# Altium project PWR_MNG.PRJPCB
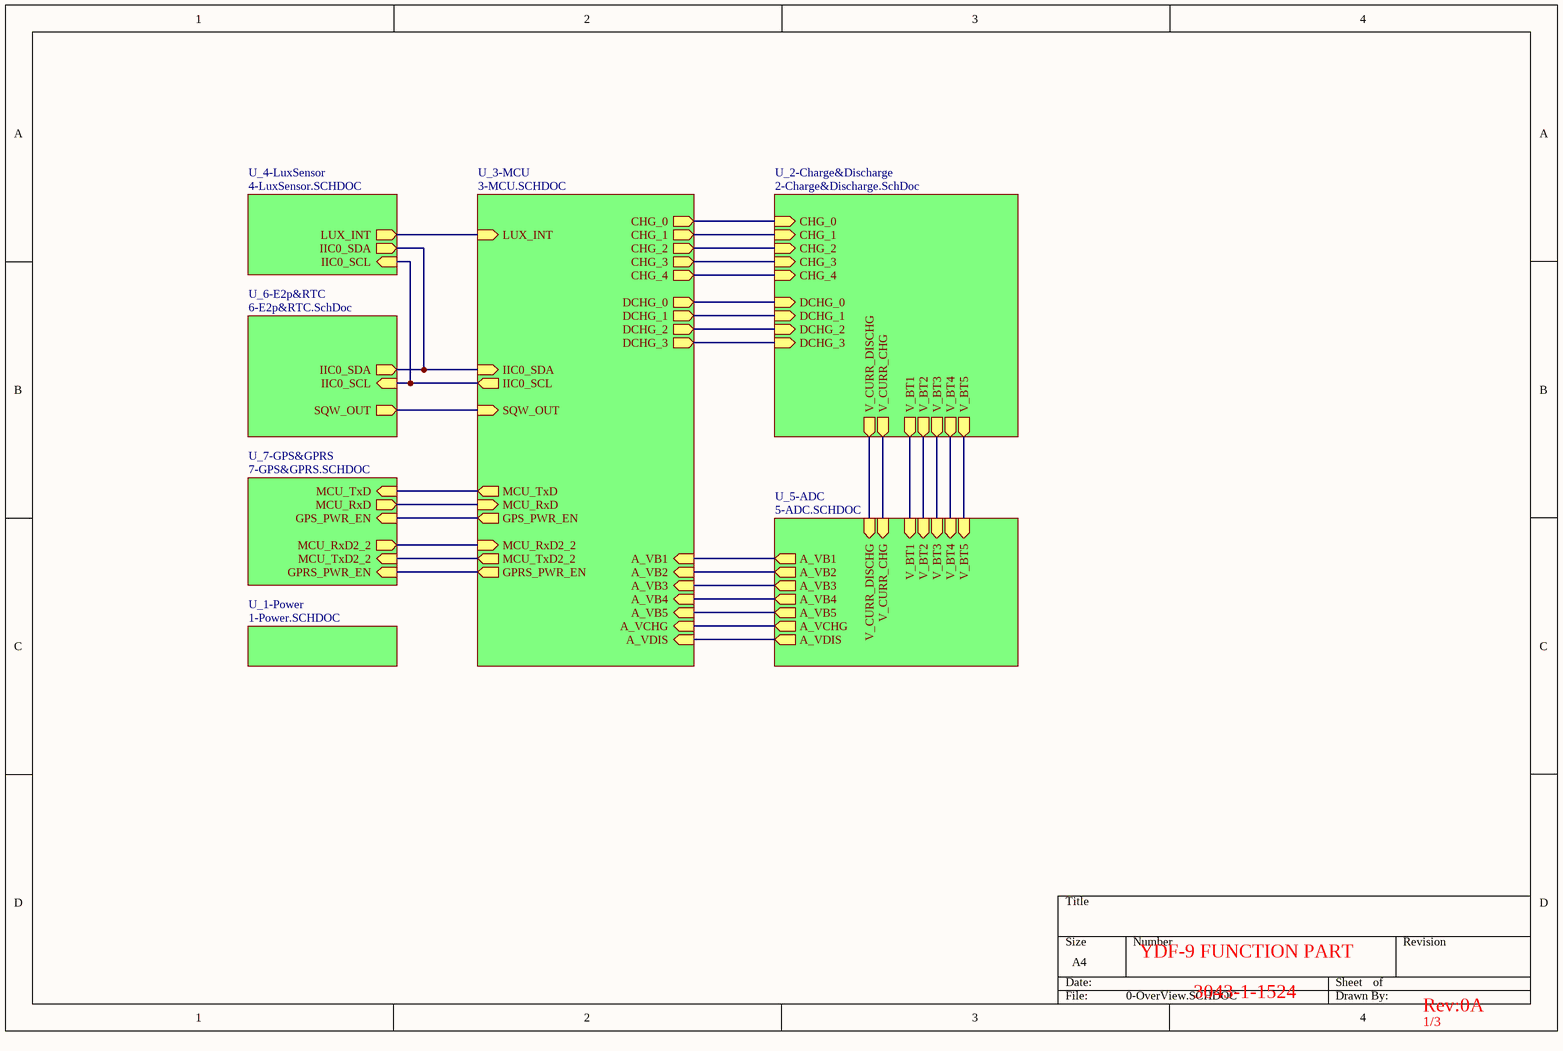
[diagram p0: 0-OverView.SCHDOC]
.TITLE: aaaaa
8 sheets, 152 parts. Net scope: hierarchical (ports join the sheet entries above them; power ports are global).
Board file: 3043-1-1532.PcbDoc
Sheets:
  0-OverView.SCHDOC
    U_2-Charge&Discharge = 2-Charge&Discharge.SchDoc
    U_1-Power = 1-Power.SCHDOC
    U_3-MCU = 3-MCU.SCHDOC
    U_5-ADC = 5-ADC.SCHDOC
    U_6-E2p&RTC = 6-E2p&RTC.SchDoc
    U_4-LuxSensor = 4-LuxSensor.SCHDOC
    U_7-GPS&GPRS = 7-GPS&GPRS.SCHDOC

## Sheet 0-OverView.SCHDOC
size A4

### Sub-sheets
U_1-Power = 1-Power.SCHDOC: no entries
U_2-Charge&Discharge = 2-Charge&Discharge.SchDoc: V_BT1 (out), V_BT2 (out), V_BT3 (out), V_BT4 (out), V_BT5 (out), V_CURR_CHG (out), V_CURR_DISCHG (out), CHG_2 (in), CHG_3 (in), DCHG_0 (in), CHG_4 (in), CHG_0 (in), DCHG_1 (in), CHG_1 (in), DCHG_2 (in), DCHG_3 (in)
U_3-MCU = 3-MCU.SCHDOC: IIC0_SDA (in), IIC0_SCL (out), SQW_OUT (in), A_VDIS (in), A_VB5 (in), A_VCHG (in), A_VB1 (in), A_VB4 (in), A_VB2 (in), A_VB3 (in), GPRS_PWR_EN (out), MCU_RxD2_2 (in), GPS_PWR_EN (out), MCU_TxD2_2 (out), MCU_RxD (in), CHG_3 (out), CHG_4 (out), CHG_0 (out), CHG_1 (out), CHG_2 (out), DCHG_0 (out), DCHG_1 (out), DCHG_2 (out), DCHG_3 (out), LUX_INT (in), MCU_TxD (out)
U_4-LuxSensor = 4-LuxSensor.SCHDOC: IIC0_SCL (in), IIC0_SDA (out), LUX_INT (out)
U_5-ADC = 5-ADC.SCHDOC: V_BT5 (in), V_BT3 (in), V_BT2 (in), V_BT4 (in), V_BT1 (in), A_VDIS (out), A_VB3 (out), A_VB5 (out), A_VB1 (out), A_VB4 (out), A_VCHG (out), A_VB2 (out), V_CURR_DISCHG (in), V_CURR_CHG (in)
U_6-E2p&RTC = 6-E2p&RTC.SchDoc: IIC0_SCL (in), IIC0_SDA (out), SQW_OUT (out)
U_7-GPS&GPRS = 7-GPS&GPRS.SCHDOC: GPS_PWR_EN (in), MCU_RxD (out), MCU_TxD2_2 (in), GPRS_PWR_EN (in), MCU_RxD2_2 (out), MCU_TxD (in)

### Nets
A_VB1: sheet U_3-MCU/A_VB1, sheet U_5-ADC/A_VB1
A_VB2: sheet U_3-MCU/A_VB2, sheet U_5-ADC/A_VB2
A_VB3: sheet U_3-MCU/A_VB3, sheet U_5-ADC/A_VB3
A_VB4: sheet U_3-MCU/A_VB4, sheet U_5-ADC/A_VB4
A_VB5: sheet U_3-MCU/A_VB5, sheet U_5-ADC/A_VB5
A_VCHG: sheet U_2-Charge&Discharge/V_CURR_CHG, sheet U_3-MCU/A_VCHG, sheet U_5-ADC/A_VCHG, sheet U_5-ADC/V_CURR_CHG
A_VDIS: sheet U_2-Charge&Discharge/V_CURR_DISCHG, sheet U_3-MCU/A_VDIS, sheet U_5-ADC/A_VDIS, sheet U_5-ADC/V_CURR_DISCHG
CHG_0: sheet U_2-Charge&Discharge/CHG_0, sheet U_3-MCU/CHG_0
CHG_1: sheet U_2-Charge&Discharge/CHG_1, sheet U_3-MCU/CHG_1
CHG_2: sheet U_2-Charge&Discharge/CHG_2, sheet U_3-MCU/CHG_2
CHG_3: sheet U_2-Charge&Discharge/CHG_3, sheet U_3-MCU/CHG_3
CHG_4: sheet U_2-Charge&Discharge/CHG_4, sheet U_3-MCU/CHG_4
DCHG_0: sheet U_2-Charge&Discharge/DCHG_0, sheet U_3-MCU/DCHG_0
DCHG_1: sheet U_2-Charge&Discharge/DCHG_1, sheet U_3-MCU/DCHG_1
DCHG_2: sheet U_2-Charge&Discharge/DCHG_2, sheet U_3-MCU/DCHG_2
DCHG_3: sheet U_2-Charge&Discharge/DCHG_3, sheet U_3-MCU/DCHG_3
GPRS_PWR_EN: sheet U_3-MCU/GPRS_PWR_EN, sheet U_7-GPS&GPRS/GPRS_PWR_EN
GPS_PWR_EN: sheet U_3-MCU/GPS_PWR_EN, sheet U_7-GPS&GPRS/GPS_PWR_EN
IIC0_SCL: sheet U_3-MCU/IIC0_SCL, sheet U_6-E2p&RTC/IIC0_SCL, sheet U_4-LuxSensor/IIC0_SCL
IIC0_SDA: sheet U_3-MCU/IIC0_SDA, sheet U_6-E2p&RTC/IIC0_SDA, sheet U_4-LuxSensor/IIC0_SDA
LUX_INT: sheet U_3-MCU/LUX_INT, sheet U_4-LuxSensor/LUX_INT
MCU_RxD: sheet U_3-MCU/MCU_RxD, sheet U_7-GPS&GPRS/MCU_RxD
MCU_RxD2_2: sheet U_3-MCU/MCU_RxD2_2, sheet U_7-GPS&GPRS/MCU_RxD2_2
MCU_TxD: sheet U_3-MCU/MCU_TxD, sheet U_7-GPS&GPRS/MCU_TxD
MCU_TxD2_2: sheet U_3-MCU/MCU_TxD2_2, sheet U_7-GPS&GPRS/MCU_TxD2_2
SQW_OUT: sheet U_3-MCU/SQW_OUT, sheet U_6-E2p&RTC/SQW_OUT
V_BT1: sheet U_2-Charge&Discharge/V_BT1, sheet U_5-ADC/V_BT1
V_BT2: sheet U_2-Charge&Discharge/V_BT2, sheet U_5-ADC/V_BT2
V_BT3: sheet U_2-Charge&Discharge/V_BT3, sheet U_5-ADC/V_BT3
V_BT4: sheet U_2-Charge&Discharge/V_BT4, sheet U_5-ADC/V_BT4
V_BT5: sheet U_2-Charge&Discharge/V_BT5, sheet U_5-ADC/V_BT5

### Notes on the sheet
- YDF-9 FUNCTION PART
- 3043-1-1524
- Rev:0A
- 1/3

## Sheet 2-Charge&Discharge.SchDoc
size A4
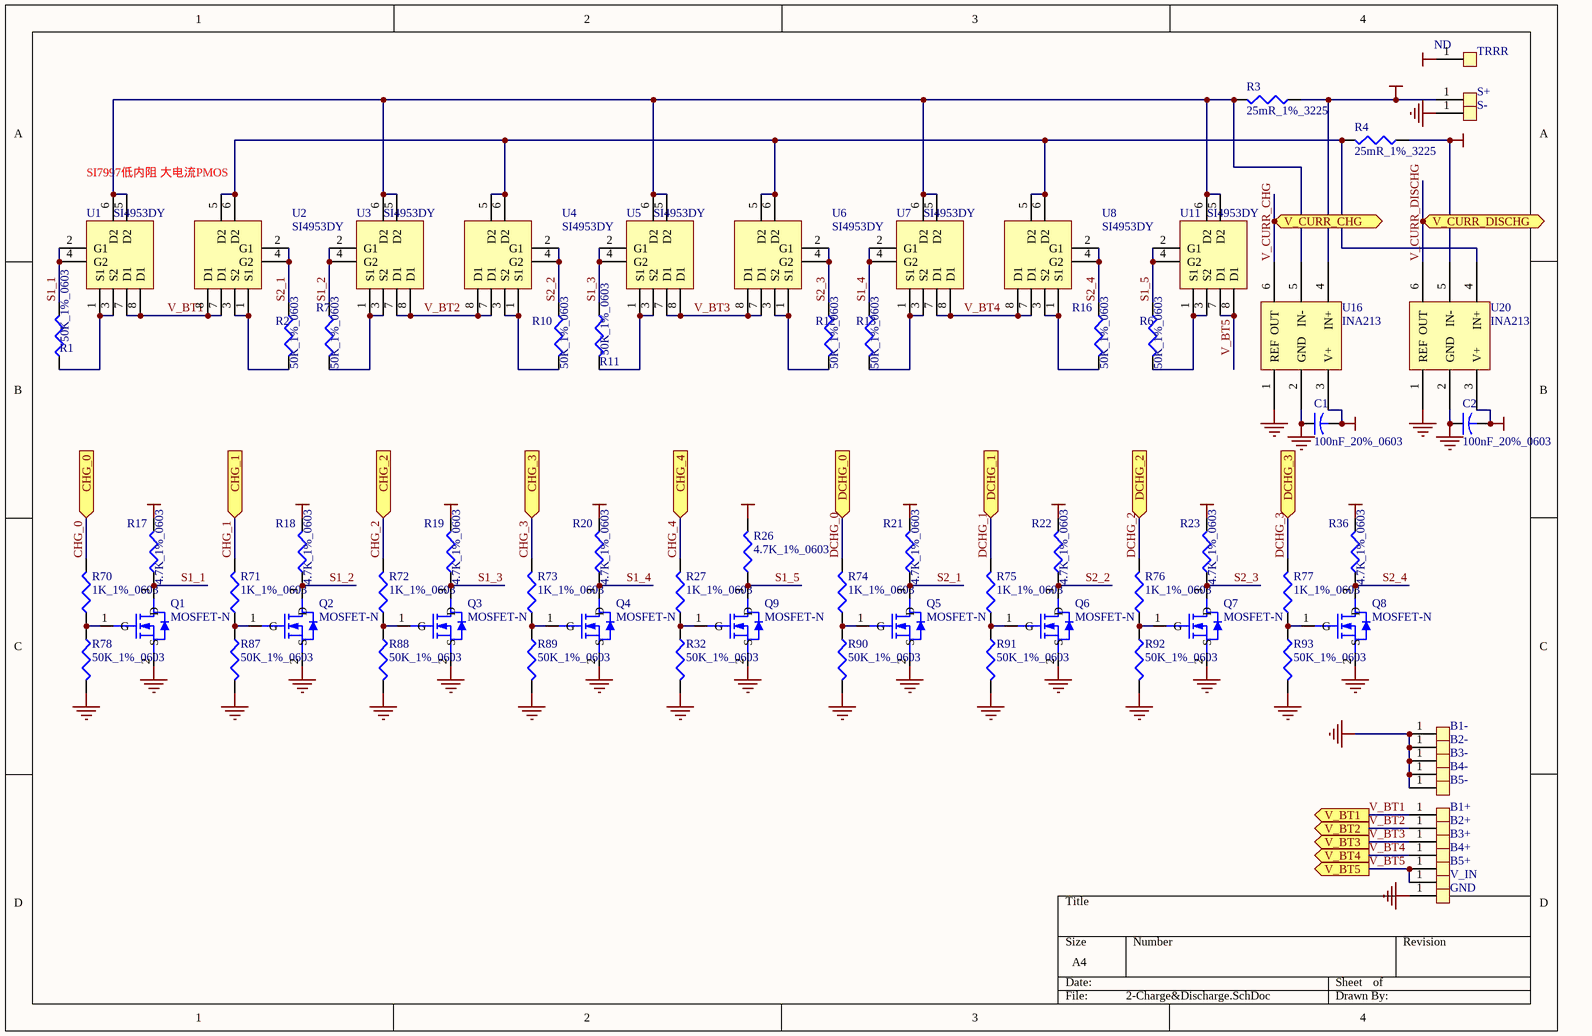
[diagram p1: 2-Charge&Discharge.SchDoc]

### Parts
B1+  ND  [END_1.5_2.8]  (value not drawn)
B1-  ND  [END_1.5_2.8]  (value not drawn)
B2+  ND  [END_1.5_2.8]  (value not drawn)
B2-  ND  [END_1.5_2.8]  (value not drawn)
B3+  ND  [END_1.5_2.8]  (value not drawn)
B3-  ND  [END_1.5_2.8]  (value not drawn)
B4+  ND  [END_1.5_2.8]  (value not drawn)
B4-  ND  [END_1.5_2.8]  (value not drawn)
B5+  ND  [END_1.5_2.8]  (value not drawn)
B5-  ND  [END_1.5_2.8]  (value not drawn)
C1  100nF_20%_0603  [C1608-0603]
C2  100nF_20%_0603  [C1608-0603]
GND  ND  [END_3_6]  (value not drawn)
Q1  MOSFET-N  [SO-G3/C2.5]
Q2  MOSFET-N  [SO-G3/C2.5]
Q3  MOSFET-N  [SO-G3/C2.5]
Q4  MOSFET-N  [SO-G3/C2.5]
Q5  MOSFET-N  [SO-G3/C2.5]
Q6  MOSFET-N  [SO-G3/C2.5]
Q7  MOSFET-N  [SO-G3/C2.5]
Q8  MOSFET-N  [SO-G3/C2.5]
Q9  MOSFET-N  [SO-G3/C2.5]
R1  50K_1%_0603  [C1608-0603]
R2  50K_1%_0603  [C1608-0603]
R3  25mR_1%_3225  [CR6332-2512]
R4  25mR_1%_3225  [CR6332-2512]
R6  50K_1%_0603  [C1608-0603]
R7  50K_1%_0603  [C1608-0603]
R10  50K_1%_0603  [C1608-0603]
R11  50K_1%_0603  [C1608-0603]
R12  50K_1%_0603  [C1608-0603]
R13  50K_1%_0603  [C1608-0603]
R16  50K_1%_0603  [C1608-0603]
R17  4.7K_1%_0603  [C1608-0603]
R18  4.7K_1%_0603  [C1608-0603]
R19  4.7K_1%_0603  [C1608-0603]
R20  4.7K_1%_0603  [C1608-0603]
R21  4.7K_1%_0603  [C1608-0603]
R22  4.7K_1%_0603  [C1608-0603]
R23  4.7K_1%_0603  [C1608-0603]
R26  4.7K_1%_0603  [C1608-0603]
R27  1K_1%_0603  [C1608-0603]
R32  50K_1%_0603  [C1608-0603]
R36  4.7K_1%_0603  [C1608-0603]
R70  1K_1%_0603  [C1608-0603]
R71  1K_1%_0603  [C1608-0603]
R72  1K_1%_0603  [C1608-0603]
R73  1K_1%_0603  [C1608-0603]
R74  1K_1%_0603  [C1608-0603]
R75  1K_1%_0603  [C1608-0603]
R76  1K_1%_0603  [C1608-0603]
R77  1K_1%_0603  [C1608-0603]
R78  50K_1%_0603  [C1608-0603]
R87  50K_1%_0603  [C1608-0603]
R88  50K_1%_0603  [C1608-0603]
R89  50K_1%_0603  [C1608-0603]
R90  50K_1%_0603  [C1608-0603]
R91  50K_1%_0603  [C1608-0603]
R92  50K_1%_0603  [C1608-0603]
R93  50K_1%_0603  [C1608-0603]
S+  ND  [END_1.5_2.8]  (value not drawn)
S-  ND  [END_1.5_2.8]  (value not drawn)
TRRR  ND  [END_1.5_2.8]
U1  SI4953DY  [SO-8]
U2  SI4953DY  [SO-8]
U3  SI4953DY  [SO-8]
U4  SI4953DY  [SO-8]
U5  SI4953DY  [SO-8]
U6  SI4953DY  [SO-8]
U7  SI4953DY  [SO-8]
U8  SI4953DY  [SO-8]
U11  SI4953DY  [SO-8]
U16  INA213  [SC70-6]
U20  INA213  [SC70-6]
V_IN  ND  [END_3_6]  (value not drawn)

### Ports
CHG_0 (in), CHG_1 (in), CHG_2 (in), CHG_3 (in), CHG_4 (in), DCHG_0 (in), DCHG_1 (in), DCHG_2 (in), DCHG_3 (in), V_BT1 (out), V_BT2 (out), V_BT3 (out), V_BT4 (out), V_BT5 (out), V_CURR_CHG (out), V_CURR_DISCHG (out)

### Nets
GND: B1-.1(SW) B2-.1(SW) B3-.1(SW) B4-.1(SW) B5-.1(SW) C1.1 C2.1 GND.1(SW) Q1.2(S) Q2.2(S) Q3.2(S) Q4.2(S) Q5.2(S) Q6.2(S) Q7.2(S) Q8.2(S) Q9.2(S) R32.2 R78.2 R87.2 R88.2 R89.2 R90.2 R91.2 R92.2 R93.2 S-.1(SW) U16.1(REF) U16.2(GND) U20.1(REF) U20.2(GND)
VCC_2V8: C1.2 C2.2 U16.3(V+) U20.3(V+)
VCC_BAT: R4.1 U20.5(IN-)
VCC_CHARGE: R3.1 S+.1(SW) U16.4(IN+)
VCC_SOLAR: TRRR.1(SW)
VCC_TH: R17.2 R18.2 R19.2 R20.2 R21.2 R22.2 R23.2 R26.2 R36.2
CHG_0: R70.2 ; port CHG_0
CHG_1: R71.2 ; port CHG_1
CHG_2: R72.2 ; port CHG_2
CHG_3: R73.2 ; port CHG_3
CHG_4: R27.2 ; port CHG_4
DCHG_0: R74.2 ; port DCHG_0
DCHG_1: R75.2 ; port DCHG_1
DCHG_2: R76.2 ; port DCHG_2
DCHG_3: R77.2 ; port DCHG_3
S1_1: Q1.3(D) R1.2 R17.1 U1.2(G1) U1.4(G2)
S1_2: Q2.3(D) R7.1 R18.1 U3.2(G1) U3.4(G2)
S1_3: Q3.3(D) R11.1 R19.1 U5.2(G1) U5.4(G2)
S1_4: Q4.3(D) R13.1 R20.1 U7.2(G1) U7.4(G2)
S1_5: Q9.3(D) R6.1 R26.1 U11.2(G1) U11.4(G2)
S2_1: Q5.3(D) R2.1 R21.1 U2.2(G1) U2.4(G2)
S2_2: Q6.3(D) R10.1 R22.1 U4.2(G1) U4.4(G2)
S2_3: Q7.3(D) R12.1 R23.1 U6.2(G1) U6.4(G2)
S2_4: Q8.3(D) R16.1 R36.1 U8.2(G1) U8.4(G2)
V_BT1: B1+.1(SW) U1.7(D1) U1.8(D1) U2.7(D1) U2.8(D1) ; port V_BT1
V_BT2: B2+.1(SW) U3.7(D1) U3.8(D1) U4.7(D1) U4.8(D1) ; port V_BT2
V_BT3: B3+.1(SW) U5.7(D1) U5.8(D1) U6.7(D1) U6.8(D1) ; port V_BT3
V_BT4: B4+.1(SW) U7.7(D1) U7.8(D1) U8.7(D1) U8.8(D1) ; port V_BT4
V_BT5: B5+.1(SW) U11.7(D1) U11.8(D1) V_IN.1(SW) ; port V_BT5
V_CURR_CHG: U16.6(OUT) ; port V_CURR_CHG  [project net A_VCHG]
V_CURR_DISCHG: U20.6(OUT) ; port V_CURR_DISCHG  [project net A_VDIS]
NetQ1_1: Q1.1(G) R70.1 R78.1
NetQ2_1: Q2.1(G) R71.1 R87.1
NetQ3_1: Q3.1(G) R72.1 R88.1
NetQ4_1: Q4.1(G) R73.1 R89.1
NetQ5_1: Q5.1(G) R74.1 R90.1
NetQ6_1: Q6.1(G) R75.1 R91.1
NetQ7_1: Q7.1(G) R76.1 R92.1
NetQ8_1: Q8.1(G) R77.1 R93.1
NetQ9_1: Q9.1(G) R27.1 R32.1
NetR1_1: R1.1 U1.1(S1) U1.3(S2)
NetR2_2: R2.2 U2.1(S1) U2.3(S2)
NetR3_2: R3.2 U1.5(D2) U1.6(D2) U3.5(D2) U3.6(D2) U5.5(D2) U5.6(D2) U7.5(D2) U7.6(D2) U11.5(D2) U11.6(D2) U16.5(IN-)
NetR4_2: R4.2 U2.5(D2) U2.6(D2) U4.5(D2) U4.6(D2) U6.5(D2) U6.6(D2) U8.5(D2) U8.6(D2) U20.4(IN+)
NetR6_2: R6.2 U11.1(S1) U11.3(S2)
NetR7_2: R7.2 U3.1(S1) U3.3(S2)
NetR10_2: R10.2 U4.1(S1) U4.3(S2)
NetR11_2: R11.2 U5.1(S1) U5.3(S2)
NetR12_2: R12.2 U6.1(S1) U6.3(S2)
NetR13_2: R13.2 U7.1(S1) U7.3(S2)
NetR16_2: R16.2 U8.1(S1) U8.3(S2)

### Notes on the sheet
- SI7997低内阻 大电流PMOS

### Library data of the parts
C1 C2 = Cap2: Capacitor; Value: 0.1uF 20% 0603; Published: 23-Sep-2002; Publisher: Altium Limited
R1 R2 R6 R7 R10-R13 R16-R23 R26 R27 R32 R36 R70-R78 R87-R93 = Res3: Resistor; Value: 1K%5 0603; Published: 8-Jun-2000; Revision: July-2002: Re-released for DXP Platform.; Publisher: Altium Limited
R3 R4 = Res3: Resistor; Value: 150R %5 0603; Published: 8-Jun-2000; Revision: July-2002: Re-released for DXP Platform.; Publisher: Altium Limited

## Sheet 1-Power.SCHDOC
size A4
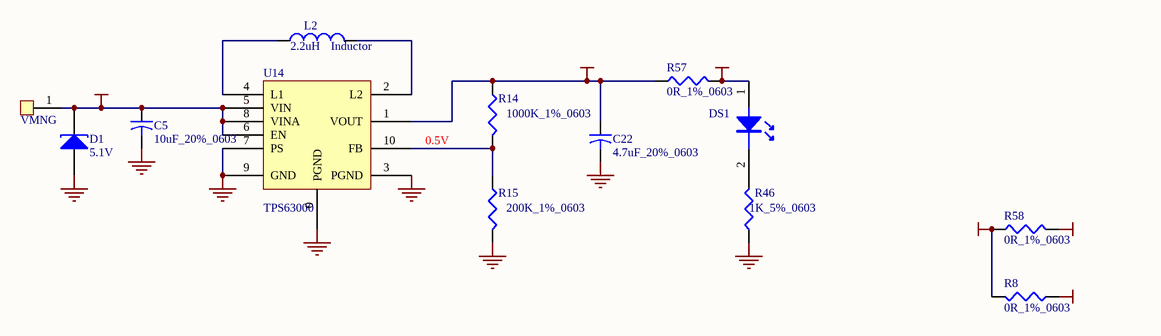
[diagram p2: 1-Power.SCHDOC]

### Parts
C5  10uF_20%_0603  [C1608-0603]
C22  4.7uF_20%_0603  [C1608-0603]
D1  5.1V  [LED0805]
DS1  LED  [LED0805]  (value not drawn)
L2  Inductor  value 2.2uH  [L3x3x1.5_5A]
R8  0R_1%_0603  [C1608-0603]
R14  1000K_1%_0603  [C1608-0603]
R15  200K_1%_0603  [C1608-0603]
R46  1K_5%_0603  [C1608-0603]
R57  0R_1%_0603  [C1608-0603]
R58  0R_1%_0603  [C1608-0603]
U14  TPS63000  [QFN-10]
VMNG  ND  [END_3_6]  (value not drawn)

### Nets
GND: C5.2 C22.2 D1.1(A) R15.2 R46.1 U14.0(PGND) U14.3(PGND) U14.7(PS) U14.9(GND)
VCC_2V8: DS1.1 R8.2 R57.2 R58.1
VCC_MCU: R8.1
VCC_MNG: C5.1 D1.2(K) U14.5(VIN) U14.6(EN) U14.8(VINA) VMNG.1(SW)
VCC_OUT: C22.1 R14.1 R57.1 U14.1(VOUT)
VCC_TH: R58.2
NetDS1_2: DS1.2 R46.2
NetL2_1: L2.1 U14.4(L1)
NetL2_2: L2.2 U14.2(L2)
NetR14_2: R14.2 R15.1 U14.10(FB)

### Notes on the sheet
- 0.5V

### Library data of the parts
C5 C22 = Cap2: Capacitor; Value: 0.1uF 20% 0603; Published: 23-Sep-2002; Publisher: Altium Limited
D1 = D Tunnel1: Tunnel Diode - RLC Model; Published: 8-Jun-2000; LatestRevisionDate: 17-Jul-2002; LatestRevisionNote: Re-released for DXP Platform.; Publisher: Altium Limited
R8 R14 R15 R57 R58 = Res3: Resistor; Value: 1K%5 0603; Published: 8-Jun-2000; Revision: July-2002: Re-released for DXP Platform.; Publisher: Altium Limited
R46 = Res3: Resistor; Value: 1K; Published: 8-Jun-2000; Revision: July-2002: Re-released for DXP Platform.; Publisher: Altium Limited
L2 = Inductor: Published: 8-Jun-2000; Revision: July-2002: Re-released for DXP Platform.; Publisher: Altium Limited

## Sheet 3-MCU.SCHDOC
size A4
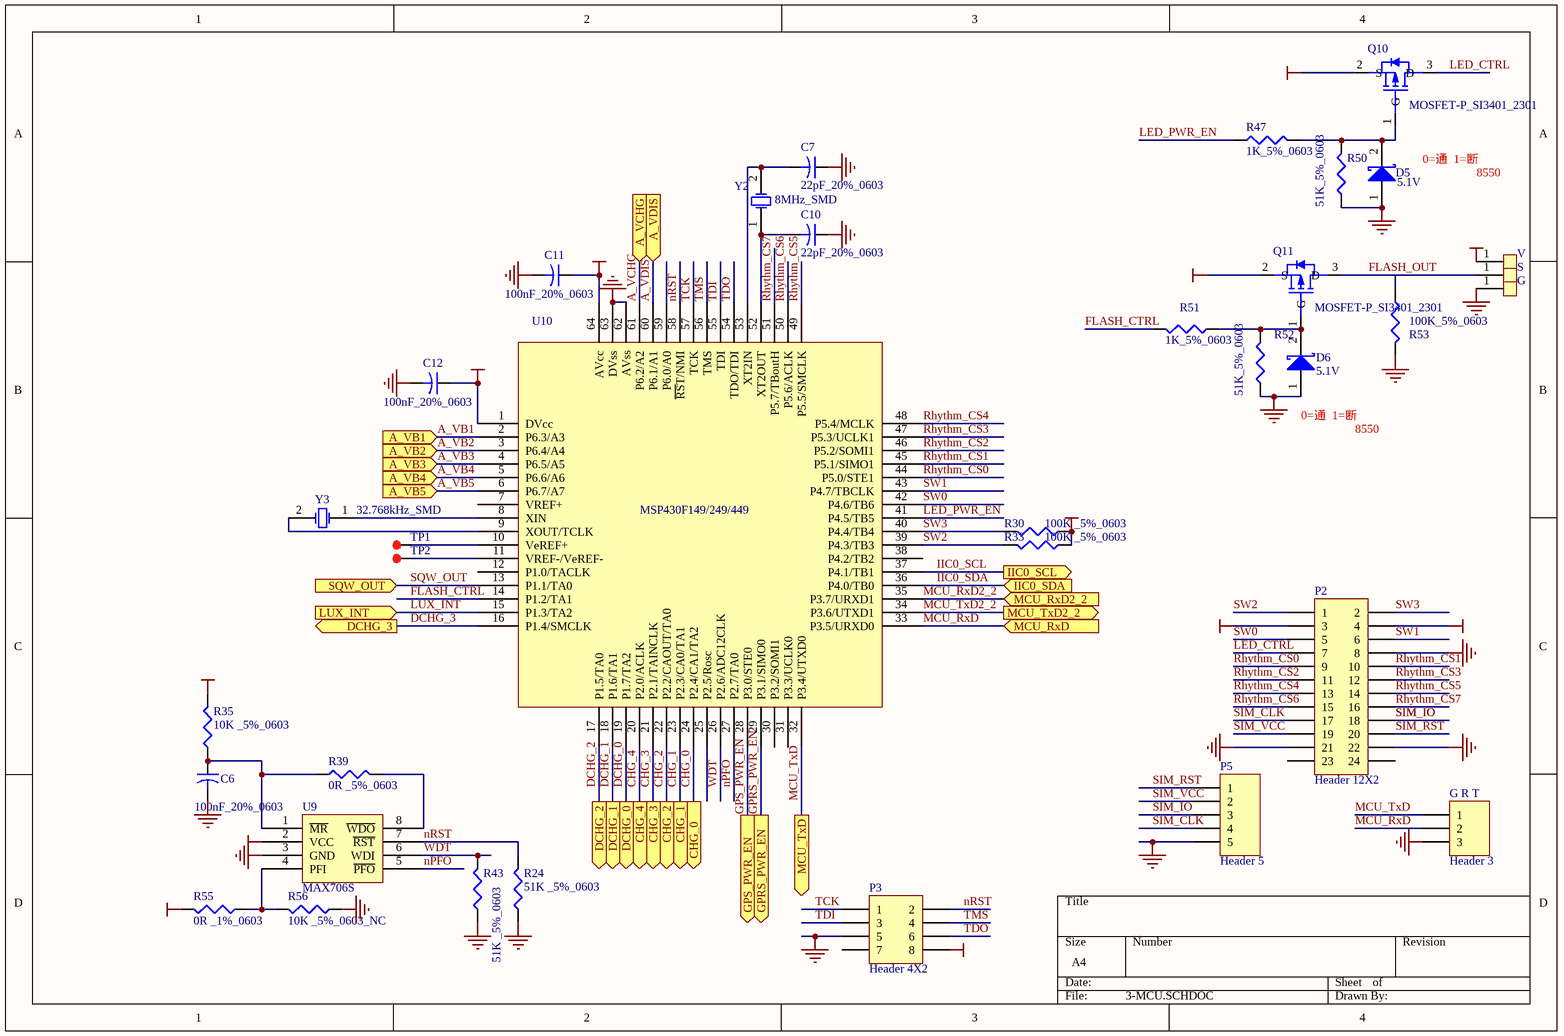
[diagram p3: 3-MCU.SCHDOC]

### Parts
C6  100nF_20%_0603  [C1608-0603]
C7  22pF_20%_0603  [C1608-0603]
C10  22pF_20%_0603  [C1608-0603]
C11  100nF_20%_0603  [C1608-0603]
C12  100nF_20%_0603  [C1608-0603]
D5  5.1V  [LED0805]
D6  5.1V  [LED0805]
G  ND  [END_1.5_2.8]  (value not drawn)
G_R_T  Header 3  [XH-03H]
P2  Header 12X2  [HDR2X12]
P3  Header 4X2  [HDR2X4]
P5  Header 5  [HDR1X5]
Q10  MOSFET-P_SI3401_2301  [SO-G3/C2.5]
Q11  MOSFET-P_SI3401_2301  [SO-G3/C2.5]
R24  51K _5%_0603  [C1608-0603]
R30  100K _5%_0603  [C1608-0603]
R33  100K _5%_0603  [C1608-0603]
R35  10K _5%_0603  [C1608-0603]
R39  0R _5%_0603  [C1608-0603]
R43  51K _5%_0603  [C1608-0603]
R47  1K_5%_0603  [C1608-0603]
R50  51K_5%_0603  [C1608-0603]
R51  1K_5%_0603  [C1608-0603]
R52  51K_5%_0603  [C1608-0603]
R53  100K_5%_0603  [C1608-0603]
R55  0R _1%_0603  [C1608-0603]
R56  10K _5%_0603_NC  [C1608-0603]
S  ND  [END_1.5_2.8]  (value not drawn)
TP1  TP  [TP_1MM]  (value not drawn)
TP2  TP  [TP_1MM]  (value not drawn)
U9  MAX706S  [SO-8]
U10  MSP430F149/249/449  [QFP-64]
V  ND  [END_1.5_2.8]  (value not drawn)
Y2  8MHz_SMD  [XTAL-P4mm_SMD]
Y3  32.768kHz_SMD  [XTAL-3216]

### Ports
A_VB1 (in), A_VB2 (in), A_VB3 (in), A_VB4 (in), A_VB5 (in), A_VCHG (in), A_VDIS (in), CHG_0 (out), CHG_1 (out), CHG_2 (out), CHG_3 (out), CHG_4 (out), DCHG_0 (out), DCHG_1 (out), DCHG_2 (out), DCHG_3 (out), GPRS_PWR_EN (out), GPS_PWR_EN (out), IIC0_SCL (out), IIC0_SDA (in), LUX_INT (in), MCU_RxD2_2 (in), MCU_RxD (in), MCU_TxD2_2 (out), MCU_TxD (out), SQW_OUT (in)

### Nets
GND: C6.2 C7.1 C10.1 C11.2 C12.2 D5.1(A) D6.1(A) G.1(SW) G_R_T.3 P2.8 P2.21 P2.22 P3.5 P5.5 R24.1 R43.1 R50.1 R52.1 R53.2 R56.1 U9.3(GND) U10.62(AVss) U10.63(DVss)
VCC_2V8: P2.3 P2.4 Q10.2(S) Q11.2(S)
VCC_BAT: V.1(SW)
VCC_MCU: C11.1 C12.1 P3.8 R30.1 R33.1 R35.2 U9.2(VCC) U10.1(DVcc) U10.64(AVcc)
VCC_SOLAR: R55.2
A_VB1: U10.2(P6.3/A3) ; port A_VB1
A_VB2: U10.3(P6.4/A4) ; port A_VB2
A_VB3: U10.4(P6.5/A5) ; port A_VB3
A_VB4: U10.5(P6.6/A6) ; port A_VB4
A_VB5: U10.6(P6.7/A7) ; port A_VB5
A_VCHG: U10.61(P6.2/A2) ; port A_VCHG
A_VDIS: U10.60(P6.1/A1) ; port A_VDIS
CHG_0: U10.24(P2.4/CA1/TA2) ; port CHG_0
CHG_1: U10.23(P2.3/CA0/TA1) ; port CHG_1
CHG_2: U10.22(P2.2/CAOUT/TA0) ; port CHG_2
CHG_3: U10.21(P2.1/TAINCLK) ; port CHG_3
CHG_4: U10.20(P2.0/ACLK) ; port CHG_4
DCHG_0: U10.19(P1.7/TA2) ; port DCHG_0
DCHG_1: U10.18(P1.6/TA1) ; port DCHG_1
DCHG_2: U10.17(P1.5/TA0) ; port DCHG_2
DCHG_3: U10.16(P1.4/SMCLK) ; port DCHG_3
FLASH_CTRL: R51.2 U10.14(P1.2/TA1)
FLASH_OUT: Q11.3(D) R53.1 S.1(SW)
GPRS_PWR_EN: U10.29(P3.1/SIMO0) ; port GPRS_PWR_EN
GPS_PWR_EN: U10.28(P3.0/STE0) ; port GPS_PWR_EN
IIC0_SCL: U10.37(P4.1/TB1) ; port IIC0_SCL
IIC0_SDA: U10.36(P4.0/TB0) ; port IIC0_SDA
LED_CTRL: P2.7 Q10.3(D)
LED_PWR_EN: R47.1 U10.41(P4.5/TB5)
LUX_INT: U10.15(P1.3/TA2) ; port LUX_INT
MCU_RxD: G_R_T.2 U10.33(P3.5/URXD0) ; port MCU_RxD
MCU_RxD2_2: U10.35(P3.7/URXD1) ; port MCU_RxD2_2
MCU_TxD: G_R_T.1 U10.32(P3.4/UTXD0) ; port MCU_TxD
MCU_TxD2_2: U10.34(P3.6/UTXD1) ; port MCU_TxD2_2
nPFO: U9.5(~{PFO}) U10.27(P2.7/TA0)
nRST: P3.2 R24.2 U9.7(~{RST}) U10.58(~{RS}T/NMI)
Rhythm_CS0: P2.9 U10.44(P5.0/STE1)
Rhythm_CS1: P2.10 U10.45(P5.1/SIMO1)
Rhythm_CS2: P2.11 U10.46(P5.2/SOMI1)
Rhythm_CS3: P2.12 U10.47(P5.3/UCLK1)
Rhythm_CS4: P2.13 U10.48(P5.4/MCLK)
Rhythm_CS5: P2.14 U10.49(P5.5/SMCLK)
Rhythm_CS6: P2.15 U10.50(P5.6/ACLK)
Rhythm_CS7: P2.16 U10.51(P5.7/TBoutH)
SIM_CLK: P2.17 P5.4
SIM_IO: P2.18 P5.3
SIM_RST: P2.20 P5.1
SIM_VCC: P2.19 P5.2
SQW_OUT: U10.13(P1.1/TA0) ; port SQW_OUT
SW0: P2.5 U10.42(P4.6/TB6)
SW1: P2.6 U10.43(P4.7/TBCLK)
SW2: P2.1 R33.2 U10.39(P4.3/TB3)
SW3: P2.2 R30.2 U10.40(P4.4/TB4)
TCK: P3.1 U10.57(TCK)
TDI: P3.3 U10.55(TDI)
TDO: P3.6 U10.54(TDO/TDI)
TMS: P3.4 U10.56(TMS)
WDT: R43.2 U9.6(WDI) U10.26(P2.6/ADC12CLK)
NetC6_1: C6.1 R35.1 R39.1 U9.1(~{MR})
NetC7_2: C7.2 U10.53(XT2IN) Y2.2(OSC2)
NetC10_2: C10.2 U10.52(XT2OUT) Y2.1(OSC1)
NetD5_2: D5.2(K) Q10.1(G) R47.2 R50.2
NetD6_2: D6.2(K) Q11.1(G) R51.1 R52.2
NetR39_2: R39.2 U9.8(~{WDO})
NetR55_1: R55.1 R56.2 U9.4(PFI)
NetTP1_1: TP1.1(TP) U10.10(VeREF+)
NetTP2_1: TP2.1(TP) U10.11(VREF-/VeREF-)
NetU10_8: U10.8(XIN) Y3.1(OSC1)
NetU10_9: U10.9(XOUT/TCLK) Y3.2(OSC2)

Not connected (* = marked no-connect by the designer): P2 23 24; P3 7; U10 7(VREF+) 12(P1.0/TACLK) 25(P2.5/Rosc) 30(P3.2/SOMI1) 31(P3.3/UCLK0) 38(P4.2/TB2) 59(P6.0/A0)

### Notes on the sheet
- 0=通  1=断
- 8550

### Library data of the parts
C6 = Cap2: Capacitor; Value: 0.1uF 0603; Published: 23-Sep-2002; Publisher: Altium Limited
C7 C10-C12 = Cap2: Capacitor; Value: 0.1uF 20% 0603; Published: 23-Sep-2002; Publisher: Altium Limited
D5 D6 = D Schottky: Schottky Diode; Code - JEDEC: DO-214-AA; Published: 8-Jun-2000; Revision: July-2002: Re-released for DXP Platform.; Publisher: Altium Limited
G_R_T = Header 3: Header, 3-Pin; LatestRevisionDate: 17-Jul-2002; LatestRevisionNote: Re-released for DXP Platform.; Publisher: Altium Limited
P2 = Header 12X2: Header, 12-Pin, Dual row; LatestRevisionDate: 17-Jul-2002; LatestRevisionNote: Re-released for DXP Platform.; Publisher: Altium Limited
P3 = Header 4X2: Header, 4-Pin, Dual row; LatestRevisionDate: 17-Jul-2002; LatestRevisionNote: Re-released for DXP Platform.; Publisher: Altium Limited
P5 = Header 5: Header, 5-Pin; LatestRevisionDate: 17-Jul-2002; LatestRevisionNote: Re-released for DXP Platform.; Publisher: Altium Limited
Q10 Q11 = MOSFET-P
R24 R30 R33 R35 R39 R43 R55 R56 = Res3: Resistor; Value: 1M %5 0603_NC; Published: 8-Jun-2000; Revision: July-2002: Re-released for DXP Platform.; Publisher: Altium Limited
R47 = Res3: Resistor; Value: 1K%5 0603; Published: 8-Jun-2000; Revision: July-2002: Re-released for DXP Platform.; Publisher: Altium Limited
R50-R53 = Res3: Resistor; Published: 8-Jun-2000; Revision: July-2002: Re-released for DXP Platform.; Publisher: Altium Limited
TP1 TP2 = TP_1mm
U9 = MAX706
Y2 Y3 = XTAL: Crystal Oscillator; Published: 8-Jun-2000; Revision: July-2002: Re-released for DXP Platform.; Publisher: Altium Limited

## Sheet 5-ADC.SCHDOC
size A4
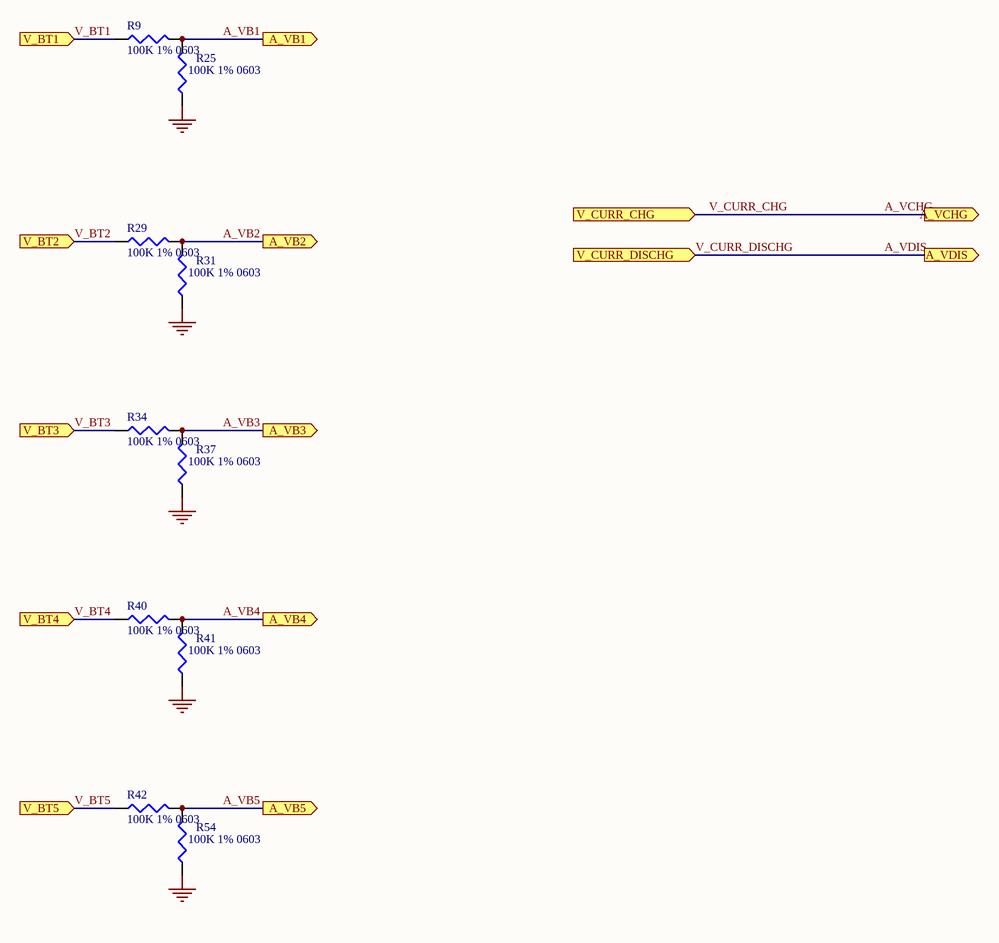
[diagram p4: 5-ADC.SCHDOC]

### Parts
R9  value 100K 1% 0603  [C1608-0603]  (hidden comment: 1K_5%_0603)
R25  value 100K 1% 0603  [C1608-0603]  (hidden comment: 1K_5%_0603)
R29  value 100K 1% 0603  [C1608-0603]  (hidden comment: 1K_5%_0603)
R31  value 100K 1% 0603  [C1608-0603]  (hidden comment: 1K_5%_0603)
R34  value 100K 1% 0603  [C1608-0603]  (hidden comment: 1K_5%_0603)
R37  value 100K 1% 0603  [C1608-0603]  (hidden comment: 1K_5%_0603)
R40  value 100K 1% 0603  [C1608-0603]  (hidden comment: 1K_5%_0603)
R41  value 100K 1% 0603  [C1608-0603]  (hidden comment: 1K_5%_0603)
R42  value 100K 1% 0603  [C1608-0603]  (hidden comment: 1K_5%_0603)
R54  value 100K 1% 0603  [C1608-0603]  (hidden comment: 1K_5%_0603)

### Ports
A_VB1 (out), A_VB2 (out), A_VB3 (out), A_VB4 (out), A_VB5 (out), A_VCHG (out), A_VDIS (out), V_BT1 (in), V_BT2 (in), V_BT3 (in), V_BT4 (in), V_BT5 (in), V_CURR_CHG (in), V_CURR_DISCHG (in)

### Nets
GND: R25.1 R31.1 R37.1 R41.1 R54.1
A_VB1: R9.2 R25.2 ; port A_VB1
A_VB2: R29.2 R31.2 ; port A_VB2
A_VB3: R34.2 R37.2 ; port A_VB3
A_VB4: R40.2 R41.2 ; port A_VB4
A_VB5: R42.2 R54.2 ; port A_VB5
A_VCHG: port A_VCHG, port V_CURR_CHG  [also labelled V_CURR_CHG]
A_VDIS: port A_VDIS, port V_CURR_DISCHG  [also labelled V_CURR_DISCHG]
V_BT1: R9.1 ; port V_BT1
V_BT2: R29.1 ; port V_BT2
V_BT3: R34.1 ; port V_BT3
V_BT4: R40.1 ; port V_BT4
V_BT5: R42.1 ; port V_BT5

### Library data of the parts
R9 R25 R29 R31 R34 R37 R40-R42 R54 = Res3: Resistor; Published: 8-Jun-2000; Revision: July-2002: Re-released for DXP Platform.; Publisher: Altium Limited

## Sheet 6-E2p&RTC.SchDoc
size A4
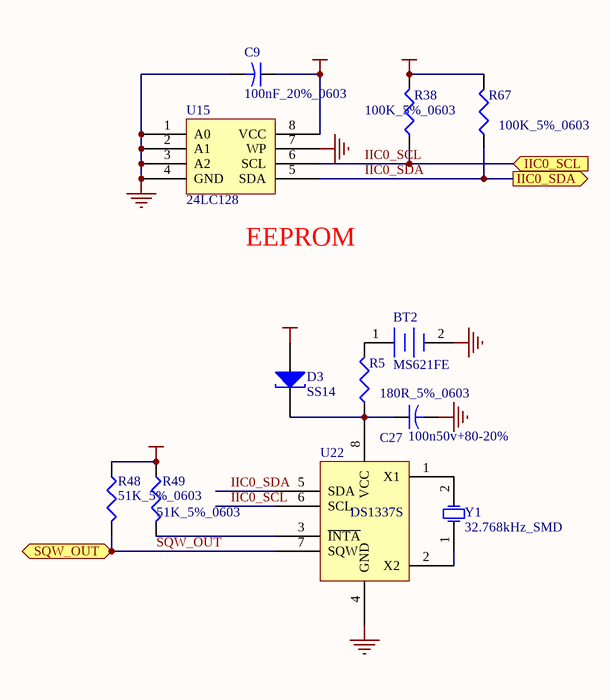
[diagram p5: 6-E2p&RTC.SchDoc]

### Parts
BT2  MS621FE  [BATT_BAK]
C9  100nF_20%_0603  [C1608-0603]
C27  value 100n50v+80-20%  [C1608-0603]  (hidden comment: Cap2)
D3  SS14  [LED0805]
R5  180R_5%_0603  [C1608-0603]
R38  100K_5%_0603  [C1608-0603]
R48  51K_5%_0603  [C1608-0603]
R49  51K_5%_0603  [C1608-0603]
R67  100K_5%_0603  [C1608-0603]
U15  24LC128  [8s1]
U22  DS1337S  [SO-8]
Y1  32.768kHz_SMD  [XTAL-3216]

### Ports
IIC0_SCL (in), IIC0_SDA (out), SQW_OUT (out)

### Nets
GND: BT2.2(-) C9.2 C27.2 U15.1(A0) U15.2(A1) U15.3(A2) U15.4(GND) U15.7(WP) U22.4(GND)
VCC_2V8: C9.1 D3.1(A) R38.2 R48.1 R49.1 R67.2 U15.8(VCC)
IIC0_SCL: R38.1 U15.6(SCL) U22.6(SCL) ; port IIC0_SCL
IIC0_SDA: R67.1 U15.5(SDA) U22.5(SDA) ; port IIC0_SDA
SQW_OUT: R48.2 U22.7(SQW) ; port SQW_OUT
NetBT2_1: BT2.1(+) R5.2
NetC27_1: C27.1 D3.2(K) R5.1 U22.8(VCC)
NetR49_2: R49.2 U22.3(~{INTA})
NetU22_1: U22.1(X1) Y1.2(OSC2)
NetU22_2: U22.2(X2) Y1.1(OSC1)

### Notes on the sheet
- (near U15) EEPROM

### Library data of the parts
BT2 = Battery: Multicell Battery; Published: 24-Mar-1999; Revision: July-2002: Re-released for DXP Platform.; Publisher: Altium Limited
C9 = Cap2: Capacitor; Value: 0.1uF 0603; Published: 23-Sep-2002; Publisher: Altium Limited
C27 = Cap2: Capacitor; Published: 23-Sep-2002; Publisher: Altium Limited
D3 = D Tunnel1: Tunnel Diode - RLC Model; Published: 8-Jun-2000; LatestRevisionDate: 17-Jul-2002; LatestRevisionNote: Re-released for DXP Platform.; Publisher: Altium Limited
R5 R38 R48 R49 R67 = Res3: Resistor; Value: 1K%5 0603; Published: 8-Jun-2000; Revision: July-2002: Re-released for DXP Platform.; Publisher: Altium Limited
U15 = 24LC02: IC
Y1 = XTAL: Crystal Oscillator; Published: 8-Jun-2000; Revision: July-2002: Re-released for DXP Platform.; Publisher: Altium Limited

## Sheet 4-LuxSensor.SCHDOC
size A4
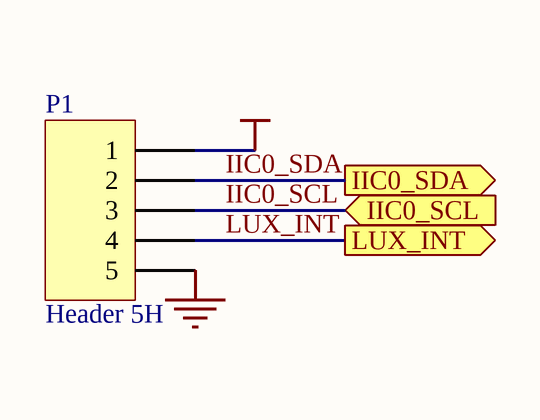
[diagram p6: 4-LuxSensor.SCHDOC]

### Parts
P1  Header 5H  [XH-05H]

### Ports
IIC0_SCL (in), IIC0_SDA (out), LUX_INT (out)

### Nets
GND: P1.5
VCC_2V8: P1.1
IIC0_SCL: P1.3 ; port IIC0_SCL
IIC0_SDA: P1.2 ; port IIC0_SDA
LUX_INT: P1.4 ; port LUX_INT

### Library data of the parts
P1 = Header 5H: Header, 5-Pin, Right Angle; LatestRevisionDate: 17-Jul-2002; LatestRevisionNote: Re-released for DXP Platform.; Publisher: Altium Limited

## Sheet 7-GPS&GPRS.SCHDOC
size A4
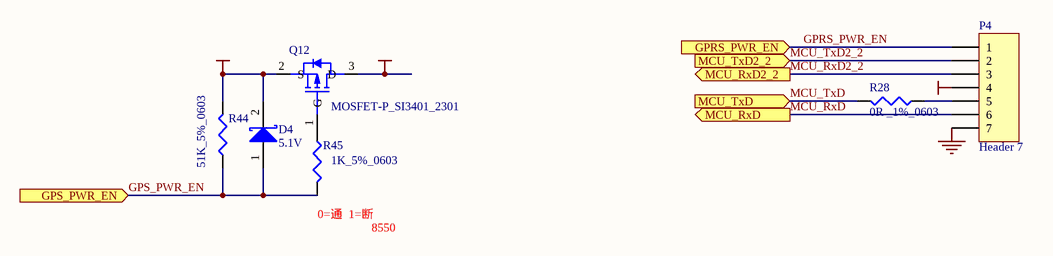
[diagram p7: 7-GPS&GPRS.SCHDOC]

### Parts
D4  5.1V  [LED0805]
P4  Header 7  [HDR1X7]
Q12  MOSFET-P_SI3401_2301  [SO-G3/C2.5]
R28  0R _1%_0603  [C1608-0603]
R44  51K_5%_0603  [C1608-0603]
R45  1K_5%_0603  [C1608-0603]

### Ports
GPRS_PWR_EN (in), GPS_PWR_EN (in), MCU_RxD2_2 (out), MCU_RxD (out), MCU_TxD2_2 (in), MCU_TxD (in)

### Nets
GND: P4.7
V_GPS: P4.4 Q12.3(D)
VCC_2V8: D4.2(K) Q12.2(S) R44.2
GPRS_PWR_EN: P4.1 ; port GPRS_PWR_EN
GPS_PWR_EN: D4.1(A) R44.1 R45.2 ; port GPS_PWR_EN
MCU_RxD: P4.6 ; port MCU_RxD
MCU_RxD2_2: P4.3 ; port MCU_RxD2_2
MCU_TxD: R28.2 ; port MCU_TxD
MCU_TxD2_2: P4.2 ; port MCU_TxD2_2
NetP4_5: P4.5 R28.1
NetQ12_1: Q12.1(G) R45.1

### Notes on the sheet
- (near R45) 0=通  1=断
- 8550

### Library data of the parts
D4 = D Schottky: Schottky Diode; Code - JEDEC: DO-214-AA; Published: 8-Jun-2000; Revision: July-2002: Re-released for DXP Platform.; Publisher: Altium Limited
P4 = Header 7: Header, 7-Pin; LatestRevisionDate: 17-Jul-2002; LatestRevisionNote: Re-released for DXP Platform.; Publisher: Altium Limited
Q12 = MOSFET-P
R28 = Res3: Resistor; Value: 1M %5 0603_NC; Published: 8-Jun-2000; Revision: July-2002: Re-released for DXP Platform.; Publisher: Altium Limited
R44 R45 = Res3: Resistor; Value: 1K%5 0603; Published: 8-Jun-2000; Revision: July-2002: Re-released for DXP Platform.; Publisher: Altium Limited

## Nets that join several sheets
GND: 2-Charge&Discharge (31 pins), 1-Power (9 pins), 3-MCU (23 pins), 5-ADC (5 pins), 6-E2p&RTC (9 pins), 4-LuxSensor (P1.5), 7-GPS&GPRS (P4.7)
VCC_2V8: 2-Charge&Discharge (C1.2 C2.2 U16.3 U20.3), 1-Power (DS1.1 R8.2 R57.2 R58.1), 3-MCU (P2.3 P2.4 Q10.2 Q11.2), 6-E2p&RTC (7 pins), 4-LuxSensor (P1.1), 7-GPS&GPRS (D4.2 Q12.2 R44.2)
VCC_BAT: 2-Charge&Discharge (R4.1 U20.5), 3-MCU (V.1)
VCC_MCU: 1-Power (R8.1), 3-MCU (9 pins)
VCC_SOLAR: 2-Charge&Discharge (TRRR.1), 3-MCU (R55.2)
VCC_TH: 2-Charge&Discharge (9 pins), 1-Power (R58.2)
A_VB1: 3-MCU (U10.2), 5-ADC (R9.2 R25.2)
A_VB2: 3-MCU (U10.3), 5-ADC (R29.2 R31.2)
A_VB3: 3-MCU (U10.4), 5-ADC (R34.2 R37.2)
A_VB4: 3-MCU (U10.5), 5-ADC (R40.2 R41.2)
A_VB5: 3-MCU (U10.6), 5-ADC (R42.2 R54.2)
A_VCHG: 2-Charge&Discharge (U16.6), 3-MCU (U10.61)
A_VDIS: 2-Charge&Discharge (U20.6), 3-MCU (U10.60)
CHG_0: 2-Charge&Discharge (R70.2), 3-MCU (U10.24)
CHG_1: 2-Charge&Discharge (R71.2), 3-MCU (U10.23)
CHG_2: 2-Charge&Discharge (R72.2), 3-MCU (U10.22)
CHG_3: 2-Charge&Discharge (R73.2), 3-MCU (U10.21)
CHG_4: 2-Charge&Discharge (R27.2), 3-MCU (U10.20)
DCHG_0: 2-Charge&Discharge (R74.2), 3-MCU (U10.19)
DCHG_1: 2-Charge&Discharge (R75.2), 3-MCU (U10.18)
DCHG_2: 2-Charge&Discharge (R76.2), 3-MCU (U10.17)
DCHG_3: 2-Charge&Discharge (R77.2), 3-MCU (U10.16)
GPRS_PWR_EN: 3-MCU (U10.29), 7-GPS&GPRS (P4.1)
GPS_PWR_EN: 3-MCU (U10.28), 7-GPS&GPRS (D4.1 R44.1 R45.2)
IIC0_SCL: 3-MCU (U10.37), 6-E2p&RTC (R38.1 U15.6 U22.6), 4-LuxSensor (P1.3)
IIC0_SDA: 3-MCU (U10.36), 6-E2p&RTC (R67.1 U15.5 U22.5), 4-LuxSensor (P1.2)
LUX_INT: 3-MCU (U10.15), 4-LuxSensor (P1.4)
MCU_RxD: 3-MCU (G_R_T.2 U10.33), 7-GPS&GPRS (P4.6)
MCU_RxD2_2: 3-MCU (U10.35), 7-GPS&GPRS (P4.3)
MCU_TxD: 3-MCU (G_R_T.1 U10.32), 7-GPS&GPRS (R28.2)
MCU_TxD2_2: 3-MCU (U10.34), 7-GPS&GPRS (P4.2)
SQW_OUT: 3-MCU (U10.13), 6-E2p&RTC (R48.2 U22.7)
V_BT1: 2-Charge&Discharge (5 pins), 5-ADC (R9.1)
V_BT2: 2-Charge&Discharge (5 pins), 5-ADC (R29.1)
V_BT3: 2-Charge&Discharge (5 pins), 5-ADC (R34.1)
V_BT4: 2-Charge&Discharge (5 pins), 5-ADC (R40.1)
V_BT5: 2-Charge&Discharge (B5+.1 U11.7 U11.8 V_IN.1), 5-ADC (R42.1)